# Altium schematic sheet [1]-Power.SchDoc
size A4; DocumentNumber: 1; SheetNumber: 1; SheetTotal: 5
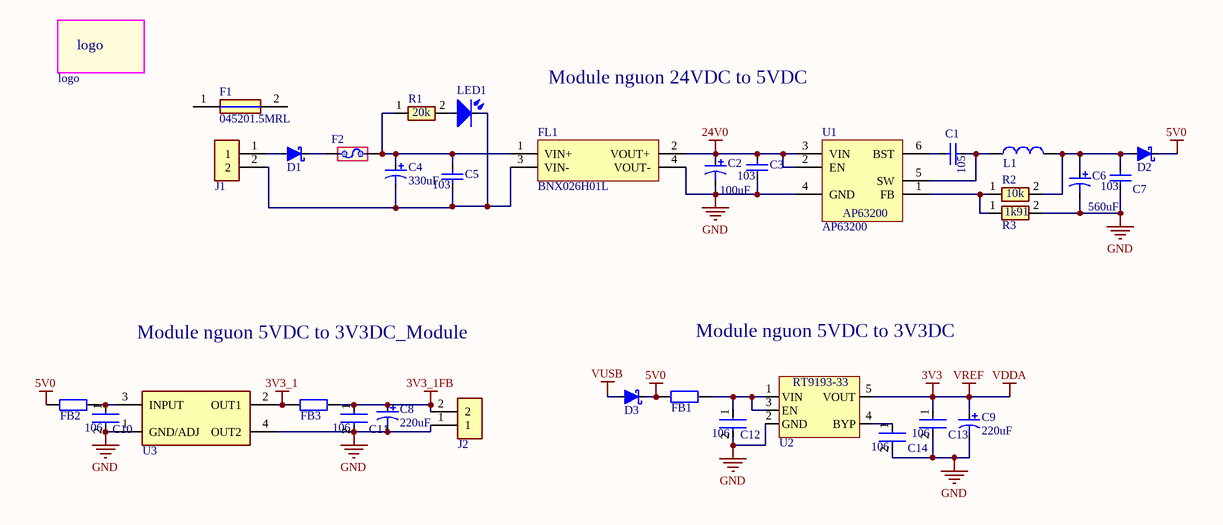
[diagram p0: [1]-Power.SchDoc]

## Parts
1  logo  [logo_new_10mm]  (no BOM)
C1  C0603_105_50V  [C0603]  (value not drawn)
C2  100uF  [CAP_ALUM_6_5x6_5]
C3  C0603_103_50V  [C0603]  (value not drawn)
C4  330uF  [CAP_ALUM_10X10]
C5  C0603_103_50V  [C0603]  (value not drawn)
C6  value 560uF  [CAP_ALUM_6_5x6_5]  (hidden comment: CAP_ALU6.3_560uF_6.3V)
C7  C0603_103_50V  [C0603]  (value not drawn)
C8  value 220uF  [CAP_TAN_7343]  (hidden comment: CAP_TAN_7343_220uF_16V)
C9  value 220uF  [CAP_TAN_7343]  (hidden comment: CAP_TAN_7343_220uF_16V)
C10  C0603_106_35V  [C0603]  (value not drawn)
C11  C0603_106_35V  [C0603]  (value not drawn)
C12  C0603_106_35V  [C0603]  (value not drawn)
C13  C0603_106_35V  [C0603]  (value not drawn)
C14  C0603_106_35V  [C0603]  (value not drawn)
D1  PMEG40T30ERX  [SOD123]  (value not drawn)
D2  PMEG40T30ERX  [SOD123]  (value not drawn)
D3  PMEG40T30ERX  [SOD123]  (value not drawn)
F1  045201.5MRL
F2  01550900M  [FUSE_HOLDER_SMD]  (value not drawn)
FB1  FERRIT_0805_1A  [FB0805]  (value not drawn)
FB2  FERRIT_0805_1A  [FB0805]  (value not drawn)
FB3  FERRIT_0805_1A  [FB0805]  (value not drawn)
FL1  BNX026H01L  [BNX024]
J1  Terminal_2P_5.08mm  [1729128]  (value not drawn)
J2  Terminal_2P_5.08mm  [1729128]  (value not drawn)
L1  IND_4.7U_1.82A_4.5X4.0  [IND_4.5x4]  (value not drawn)
LED1  LED0603_Blue  [LED0603]  (value not drawn)
R1  R0603_20k  [RES-SMD-0603]  (value not drawn)
R2  R0603_10k  [RES-SMD-0603]  (value not drawn)
R3  R0603_1k91  [RES-SMD-0603]  (value not drawn)
U1  AP63200  [SOT-23-6]
U2  RT9193-33GB  [SOT-23-5]  (value not drawn)
U3  NCP1117ST33T3G  [SOT230P700X180-4N]  (value not drawn)

## Nets
3V3: C9.1 C13.1 U2.5(VOUT)  [also labelled VDDA, VREF]
3V3_1: FB3.1 U3.2(OUT1)
3V3_1FB: C8.1 C11.1 FB3.2 J2.2
5V0: D2.2(K) D3.2(K) FB1.1 FB2.1
24V0: C2.1 C3.1 FL1.2(VOUT+) U1.2(EN) U1.3(VIN)
GND: C2.2 C3.2 C6.2 C7.2 C8.2 C9.2 C10.2 C11.2 C12.2 C13.2 C14.2 FL1.4(VOUT-) J2.1 R3.2 U1.4(GND) U2.2(GND) U3.1(GND/ADJ) U3.4(OUT2)
VUSB: D3.1(A)
NetC1_1: C1.1 U1.6(BST)
NetC1_2: C1.2 L1.1 U1.5(SW)
NetC4_1: C4.1 C5.1 F2.2 FL1.1(VIN+) R1.1
NetC4_2: C4.2 C5.2 FL1.3(VIN-) J1.2 LED1.1(K)
NetC6_1: C6.1 C7.1 D2.1(A) L1.2 R2.2
NetC10_1: C10.1 FB2.2 U3.3(INPUT)
NetC12_1: C12.1 FB1.2 U2.1(VIN) U2.3(EN)
NetC14_1: C14.1 U2.4(BYP)
NetD1_1: D1.1(A) J1.1
NetD1_2: D1.2(K) F2.1
NetLED1_2: LED1.2(A) R1.2
NetR2_1: R2.1 R3.1 U1.1(FB)

Not connected (* = marked no-connect by the designer): F1 1 2

## Notes on the sheet
- Module nguon 24VDC to 5VDC
- Module nguon 5VDC to 3V3DC_Module
- Module nguon 5VDC to 3V3DC
- Sửa đổi
- 1
- Miêu tả
- CHỈNH SỬA
- Khu vực
- Thời gian
- 2
- 3
- 4
- Họ Tên
- Chữ ký
- Ngày ký
- TỔNG CÔNG TY CÔNG NGHIỆP CNC VIETTEL
- Mã dự án
- THIẾT KẾ:
- XUẤT BẢN VẼ:
- Bản vẽ thiết kế sơ đồ nguyên lý
- TRUNG TÂM CN CK & TĐH
- KHỐI 1
- KIỂM TRA:
- Mã thiết bị
- Mã bản vẽ
- PHÊ DUYỆT:
- Tên file:
- Mã phiên bản
- Kích thước
- A4
- Trang
- (in symbol C0603_103_50V) 103
- (in symbol C0603_105_50V) 105
- (in symbol C0603_106_35V) 106
- (in symbol R0603_1k91) 1k91
- (in symbol R0603_10k) 10k
- (in symbol R0603_20k) 20k
- (in symbol RT9193-33GB) RT9193-33

## Library data of the parts
C1 = C0603_105_50V: Multilayer Ceramic Capacitors MLCC - SMD/SMT 50 V 1uF X7R 0603 10%; Manufacturer_Name: KEMET; Manufacturer_Part_Number: CC0603KRX7R9BB105; Datasheet Link: https://componentsearchengine.com/Datasheets/1/CC0603KRX7R9BB105.pdf; Height: 0.9mm; Mouser Part Number: 603-CC603KRX7R9BB105; Mouser Price/Stock: https://www.mouser.co.uk/ProductDetail/YAGEO/CC0603KRX7R9BB105?qs=6wERJjOp3mmF17%252BYi8cgJQ%3D%3D; Arrow Part Number: CC0603KRX7R9BB105; Arrow Price/Stock: https://www.arrow.com/en/products/cc0603krx7r9bb105/yageo
C2 = C_Al_100uF_35V: Capacitor Polarised; Manufacturer_Name: Panasonic; Manufacturer_Part_Number: EEH-ZK1V101XP; Datasheet Link: http://industrial.panasonic.com/cdbs/www-data/pdf/RDD0000/ABA0000C1229.pdf; Height: 8.3mm; Mouser Part Number: 667-EEH-ZK1V101XP; Mouser Price/Stock: https://www.mouser.co.uk/ProductDetail/Panasonic/EEH-ZK1V101XP?qs=FNcb6ahWXRxBYa2YKGAU8g%3D%3D; Arrow Part Number: EEH-ZK1V101XP; Arrow Price/Stock: https://www.arrow.com/en/products/eeh-zk1v101xp/panasonic
C3 C5 C7 = C0603_103_50V: Multilayer Ceramic Capacitors MLCC - SMD/SMT 50V 0.01uF X7R 0603 10%; Manufacturer_Name: KEMET; Manufacturer_Part_Number: CC0603KRX7R9BB103; Datasheet Link: https://datasheet.datasheetarchive.com/originals/distributors/Datasheets_SAMA/d9f127a4875522309d99aa7dec79633c.pdf; Height: 0.9mm; Mouser Part Number: 603-CC603KRX7R9BB103; Mouser Price/Stock: https://www.mouser.co.uk/ProductDetail/YAGEO/CC0603KRX7R9BB103?qs=AgBp2OyFlx%252BeoRRspw6PJg%3D%3D; Arrow Part Number: CC0603KRX7R9BB103; Arrow Price/Stock: https://www.arrow.com/en/products/cc0603krx7r9bb103/yageo?region=nac
C4 = C_Al_330uF_35V: Aluminum Organic Polymer Capacitors 35Vol 330uF SMD 2KHr ESR=22 mOhms AECQ200; Manufacturer_Name: KEMET; Manufacturer_Part_Number: A768MS337M1VLAS022; Datasheet Link: https://www.mouser.vn/datasheet/2/447/KEM_A4088_A768-3316438.pdf; Height: 12.2 mm; Mouser Part Number: 80-A768MS337M1VLAS22; Mouser Price/Stock: https://www.mouser.vn/ProductDetail/KEMET/A768MS337M1VLAS022?qs=sPbYRqrBIVliRmrbB6XsUw%3D%3D; ComponentLink1Description: Link; ComponentLink1URL: https://www.mouser.vn/ProductDetail/KEMET/A768MS337M1VLAS022?qs=sPbYRqrBIVliRmrbB6XsUw%3D%3D
C6 = CAP_ALU6.3_560uF_6.3V: 560 µF 6.3 V Aluminum - Polymer Capacitors Radial, Can - SMD 8mOhm 15000 Hrs @ 105°C; Manufacturer: United Chemi-Con; Part Number: APXJ6R3ARA561MF80G; Info: CAP ALUM POLY 560UF 20% 6.3V SMD; Temperature: -55°C ~ 105°C; URL: https://www.digikey.com/en/products/detail/chemi-con/APXJ6R3ARA561MF80G/10486574?s=N4IgjCBcoGwJxVAYygMwIYBsDOBTANCAPZQDaIALAAxwDMdIAuoQA4AuUIAymwE4CWAOwDmIAL6EA7ACYKiECkgYcBYmRDS4FAKzbpTVh0jc%2BQ0RJAAOS3OgK0WPIRKRyYGDDC0DIdpx4CIuKE0lQUCHaKyk5qriDaMFQABACtAGI%2BfsYAqoL8bADyqACyuOjYAK68uMEaVJIRyA4qzuowAHS0SQBqIIRgyb3MvkYguflFpeVVNRYAtPqRUHwVqi7k2n0gCIxie0A; Price: 0.87; Manufacturer Part Number: APXJ6R3ARA561MF80G
C8 C9 = CAP_TAN_7343_220uF_16V: 220 µF Molded Tantalum Capacitors 16 V 2917 (7343 Metric) 25mOhm; Manufacturer: KYOCERA AVX; Part Number: TPME227K016R0025; Info: CAP TANT 220UF 10% 16V 2917; Temperature: -55°C ~ 125°C; URL: https://www.digikey.com/en/products/detail/kyocera-avx/TPME227K016R0025/929934; Price: 4.54; Manufacturer Part Number: TPME227K016R0025
C10-C14 = C0603_106_35V: Multilayer Ceramic Capacitors MLCC - SMD/SMT 10 uF 35 VDC 20% 0603 X5R; Manufacturer_Name: Murata Electronics; Manufacturer_Part_Number: GRM188R6YA106MA73J; Datasheet Link: http://componentsearchengine.com/Datasheets/1/GRM188R6YA106MA73J.pdf; Height: 0.9mm; Mouser Part Number: 81-GRM188R6YA106MA3J; Mouser Price/Stock: https://www.mouser.co.uk/ProductDetail/Murata-Electronics/GRM188R6YA106MA73J?qs=5aG0NVq1C4xLSwNPdfnaYg%3D%3D; Arrow Part Number: GRM188R6YA106MA73J; Arrow Price/Stock: https://www.arrow.com/en/products/grm188r6ya106ma73j/murata-manufacturing?region=europe
D1-D3 = PMEG40T30ERX: Schottky Diode 40V 3A; Manufacturer_Name: Nexperia; Datasheet Link: https://assets.nexperia.com/documents/data-sheet/PMEG40T30ER.pdf; Height: 1.1mm; Manufacturer_Part_Number: PMEG40T30ERX; Mouser Part Number: 771-PMEG40T30ERX; Mouser Price/Stock: https://www.mouser.co.uk/ProductDetail/Nexperia/PMEG40T30ERX?qs=1mbolxNpo8eeG%2Fr5KLvXLA%3D%3D; Arrow Part Number: PMEG40T30ERX; Arrow Price/Stock: https://www.arrow.com/en/products/pmeg40t30erx/nexperia?region=europe
F1 = 045201.5MRL: Fuse; Manufacturer_Name: LITTELFUSE; Datasheet Link: https://componentsearchengine.com/Datasheets/2/045201.5MRL.pdf; Height: 2.69mm; Manufacturer_Part_Number: 045201.5MRL; Mouser Part Number: 576-045201.5MRL; Mouser Price/Stock: https://www.mouser.co.uk/ProductDetail/Littelfuse/045201.5MRL?qs=WtG364jHAdxFkoGkhC9sHA%3D%3D; Arrow Part Number: 045201.5MRL; Arrow Price/Stock: https://www.arrow.com/en/products/045201.5mrl/littelfuse?region=nac
F2 = 01550900M: Fuse holder; Manufacturer_Name: LITTELFUSE; Datasheet Link: http://www.littelfuse.com/~/media/electronics/datasheets/fuses/littelfuse_fuse_154_154t_154l_154tl_datasheet.pdf.pdf; Height: 3.81mm; Manufacturer_Part_Number: 01550900M; Mouser Part Number: 576-01550900M; Mouser Price/Stock: https://www.mouser.co.uk/ProductDetail/Littelfuse/01550900M?qs=DDoybve0rC%252BTXq1hqi5X1g%3D%3D; Arrow Part Number: 01550900M; Arrow Price/Stock: https://www.arrow.com/en/products/01550900m/littelfuse?region=europe
FB1-FB3 = FERRIT_0805_1A: Manufacturer: Laird-Signal Integrity Products; Part Number: MI0805J102R-10; info: FERRITE BEAD 1 KOHM 0805 1LN; Temperature: -40°C ~ 125°C; URL: https://www.digikey.com/en/products/detail/laird-signal-integrity-products/MI0805J102R-10/1015975; Price: 0.2; Manufacturer Part Number: MI0805J102R-10
FL1 = BNX026H01L: Filter; Manufacturer_Name: Murata Electronics; Datasheet Link: https://www.murata.com/en-us/products/productdetail?partno=BNX026H01%23; Height: 3.7mm; Manufacturer_Part_Number: BNX026H01L; Mouser Part Number: 81-BNX026H01L; Mouser Price/Stock: https://www.mouser.co.uk/ProductDetail/Murata-Electronics/BNX026H01L?qs=zU3EaVYbc3y78A%2FfsSIPhQ%3D%3D; Arrow Part Number: BNX026H01L; Arrow Price/Stock: https://www.arrow.com/en/products/bnx026h01l/murata-manufacturing?region=nac
J1 J2 = Terminal_2P_5.08mm: Fixed Terminal Blocks 2P 5.08mm 90DEG; Manufacturer_Name: Phoenix Contact; Datasheet Link: http://www.phoenixcontact.net/product/1729128; Height: 10.15mm; Manufacturer_Part_Number: 1729128; Mouser Part Number: 651-1729128; Mouser Price/Stock: https://www.mouser.co.uk/ProductDetail/Phoenix-Contact/1729128?qs=GFUSqQMLmmnCBVBY3dts9w%3D%3D; Arrow Part Number: 1729128; Arrow Price/Stock: https://www.arrow.com/en/products/1729128/phoenix-contact?region=nac
L1 = IND_4.7U_1.82A_4.5X4.0: Manufacturer: Würth Elektronik; Part Number: 744773047; info: FIXED IND 4.7UH 1.82A 110MOHM SM; Value: 4.7uH; Temperature: -40°C ~ 125°C; URL: https://www.digikey.com/en/products/detail/w%C3%BCrth-elektronik/744773047/1638657; Price: 1.8; Manufacturer Part Number: 744773047
LED1 = LED0603_Blue: Blue 470nm LED Indication - Discrete 3.2V 0603 (1608 Metric); Manufacturer_Name: Wurth Elektronik; Manufacturer_Part_Number: 150060BS75000; Datasheet Link: https://componentsearchengine.com/Datasheets/2/150060BS75000.pdf; Height: 0.8mm; Mouser Part Number: 710-150060BS75000; Mouser Price/Stock: https://www.mouser.co.uk/ProductDetail/Wurth-Elektronik/150060BS75000?qs=LlUlMxKIyB2DLLpXQThavA%3D%3D
R1 = R0603_20k: Resistor; Manufacturer_Name: Panasonic; Manufacturer_Part_Number: ERJ-3EKF2002V; Datasheet Link: http://industrial.panasonic.com/cdbs/www-data/pdf/RDA0000/AOA0000C86.pdf; Height: 0.55mm; Mouser Part Number: 667-ERJ-3EKF2002V; Mouser Price/Stock: https://www.mouser.co.uk/ProductDetail/Panasonic/ERJ-3EKF2002V?qs=66DK8nO8gJB3y0uxig0mNg%3D%3D; Arrow Part Number: ERJ-3EKF2002V; Arrow Price/Stock: https://www.arrow.com/en/products/erj-3ekf2002v/panasonic?region=europe
R2 = R0603_10k: Thick Film Resistors - SMD 0603 10Kohms 1% AEC-Q200; Manufacturer_Name: Panasonic; Manufacturer_Part_Number: ERJ-3EKF1002V; Datasheet Link: http://industrial.panasonic.com/cdbs/www-data/pdf/RDA0000/AOA0000C86.pdf; Height: 0.55mm; Mouser Part Number: 667-ERJ-3EKF1002V; Mouser Price/Stock: https://www.mouser.co.uk/ProductDetail/Panasonic/ERJ-3EKF1002V?qs=H7k1u0Mp9JSrGPQ5%2F5COuw%3D%3D; Arrow Part Number: ERJ-3EKF1002V; Arrow Price/Stock: https://www.arrow.com/en/products/erj-3ekf1002v/panasonic?region=europe
R3 = R0603_1k91: Resistor; Manufacturer_Name: Panasonic; Manufacturer_Part_Number: ERJ-3EKF1911V; Datasheet Link: http://industrial.panasonic.com/cdbs/www-data/pdf/RDA0000/AOA0000C86.pdf; Height: 0.55mm; Mouser Part Number: 667-ERJ-3EKF1911V; Mouser Price/Stock: https://www.mouser.co.uk/ProductDetail/Panasonic/ERJ-3EKF1911V?qs=66DK8nO8gJBdy91mE9RmMA%3D%3D; Arrow Part Number: ERJ-3EKF1911V; Arrow Price/Stock: https://www.arrow.com/en/products/erj-3ekf1911v/panasonic?region=nac
U1 = AP63200: Buck Switching Regulator IC Positive Adjustable 1.2V 1 Output 2A SOT-23-6 Thin, TSOT-23-6; Manufacturer: Diodes Incorporated; Part Number: AP63200WU-7; Temperature: -40°C ~ 85°C (TA); URL: https://www.digikey.com/en/products/detail/diodes-incorporated/AP63200WU-7/9858423; Price: 0.91; Info: Buck Switching Regulator IC Positive Adjustable 1.2V 1 Output 2A SOT-23-6 Thin, TSOT-23-6; Manufacturer Part Number: AP63200WU-7
U2 = RT9193-33GB: Linear Voltage Regulator IC Positive Fixed 1 Output 300mA SOT-23-5; Manufacturer: Richtek USA Inc.; info: IC REG LINEAR 3.3V 300MA SOT23-5; Part Number: RT9193-33GB; Temperature: -40°C ~ 125°C; URL: https://www.digikey.com/en/products/detail/richtek-usa-inc/RT9193-33GB/2470048?s=N4IgTCBcDaIEoBUCcBGJBmAtO9BxAQiALoC%2BQA; Price: 0.56; Type: IC; Manufacturer Part Number: RT9193-33GB
U3 = NCP1117ST33T3G: LDO Voltage Regulators 3.3V 1A Positive; Manufacturer_Name: onsemi; Datasheet Link: http://www.onsemi.com/pub/Collateral/NCP1117-D.PDF; Height: 1.8mm; Manufacturer_Part_Number: NCP1117ST33T3G; Mouser Part Number: 863-NCP1117ST33T3G; Mouser Price/Stock: https://www.mouser.co.uk/ProductDetail/onsemi/NCP1117ST33T3G?qs=Gev%252BmEvV0iZb%2FE8ahUDx3w%3D%3D; Arrow Part Number: NCP1117ST33T3G; Arrow Price/Stock: https://www.arrow.com/en/products/ncp1117st33t3g/on-semiconductor?region=europe